# Altium schematic sheet ETHERNET_PHY_RGMII.SchDoc
size 594 x 420 mm; SheetNumber: 22; SheetTotal: 23
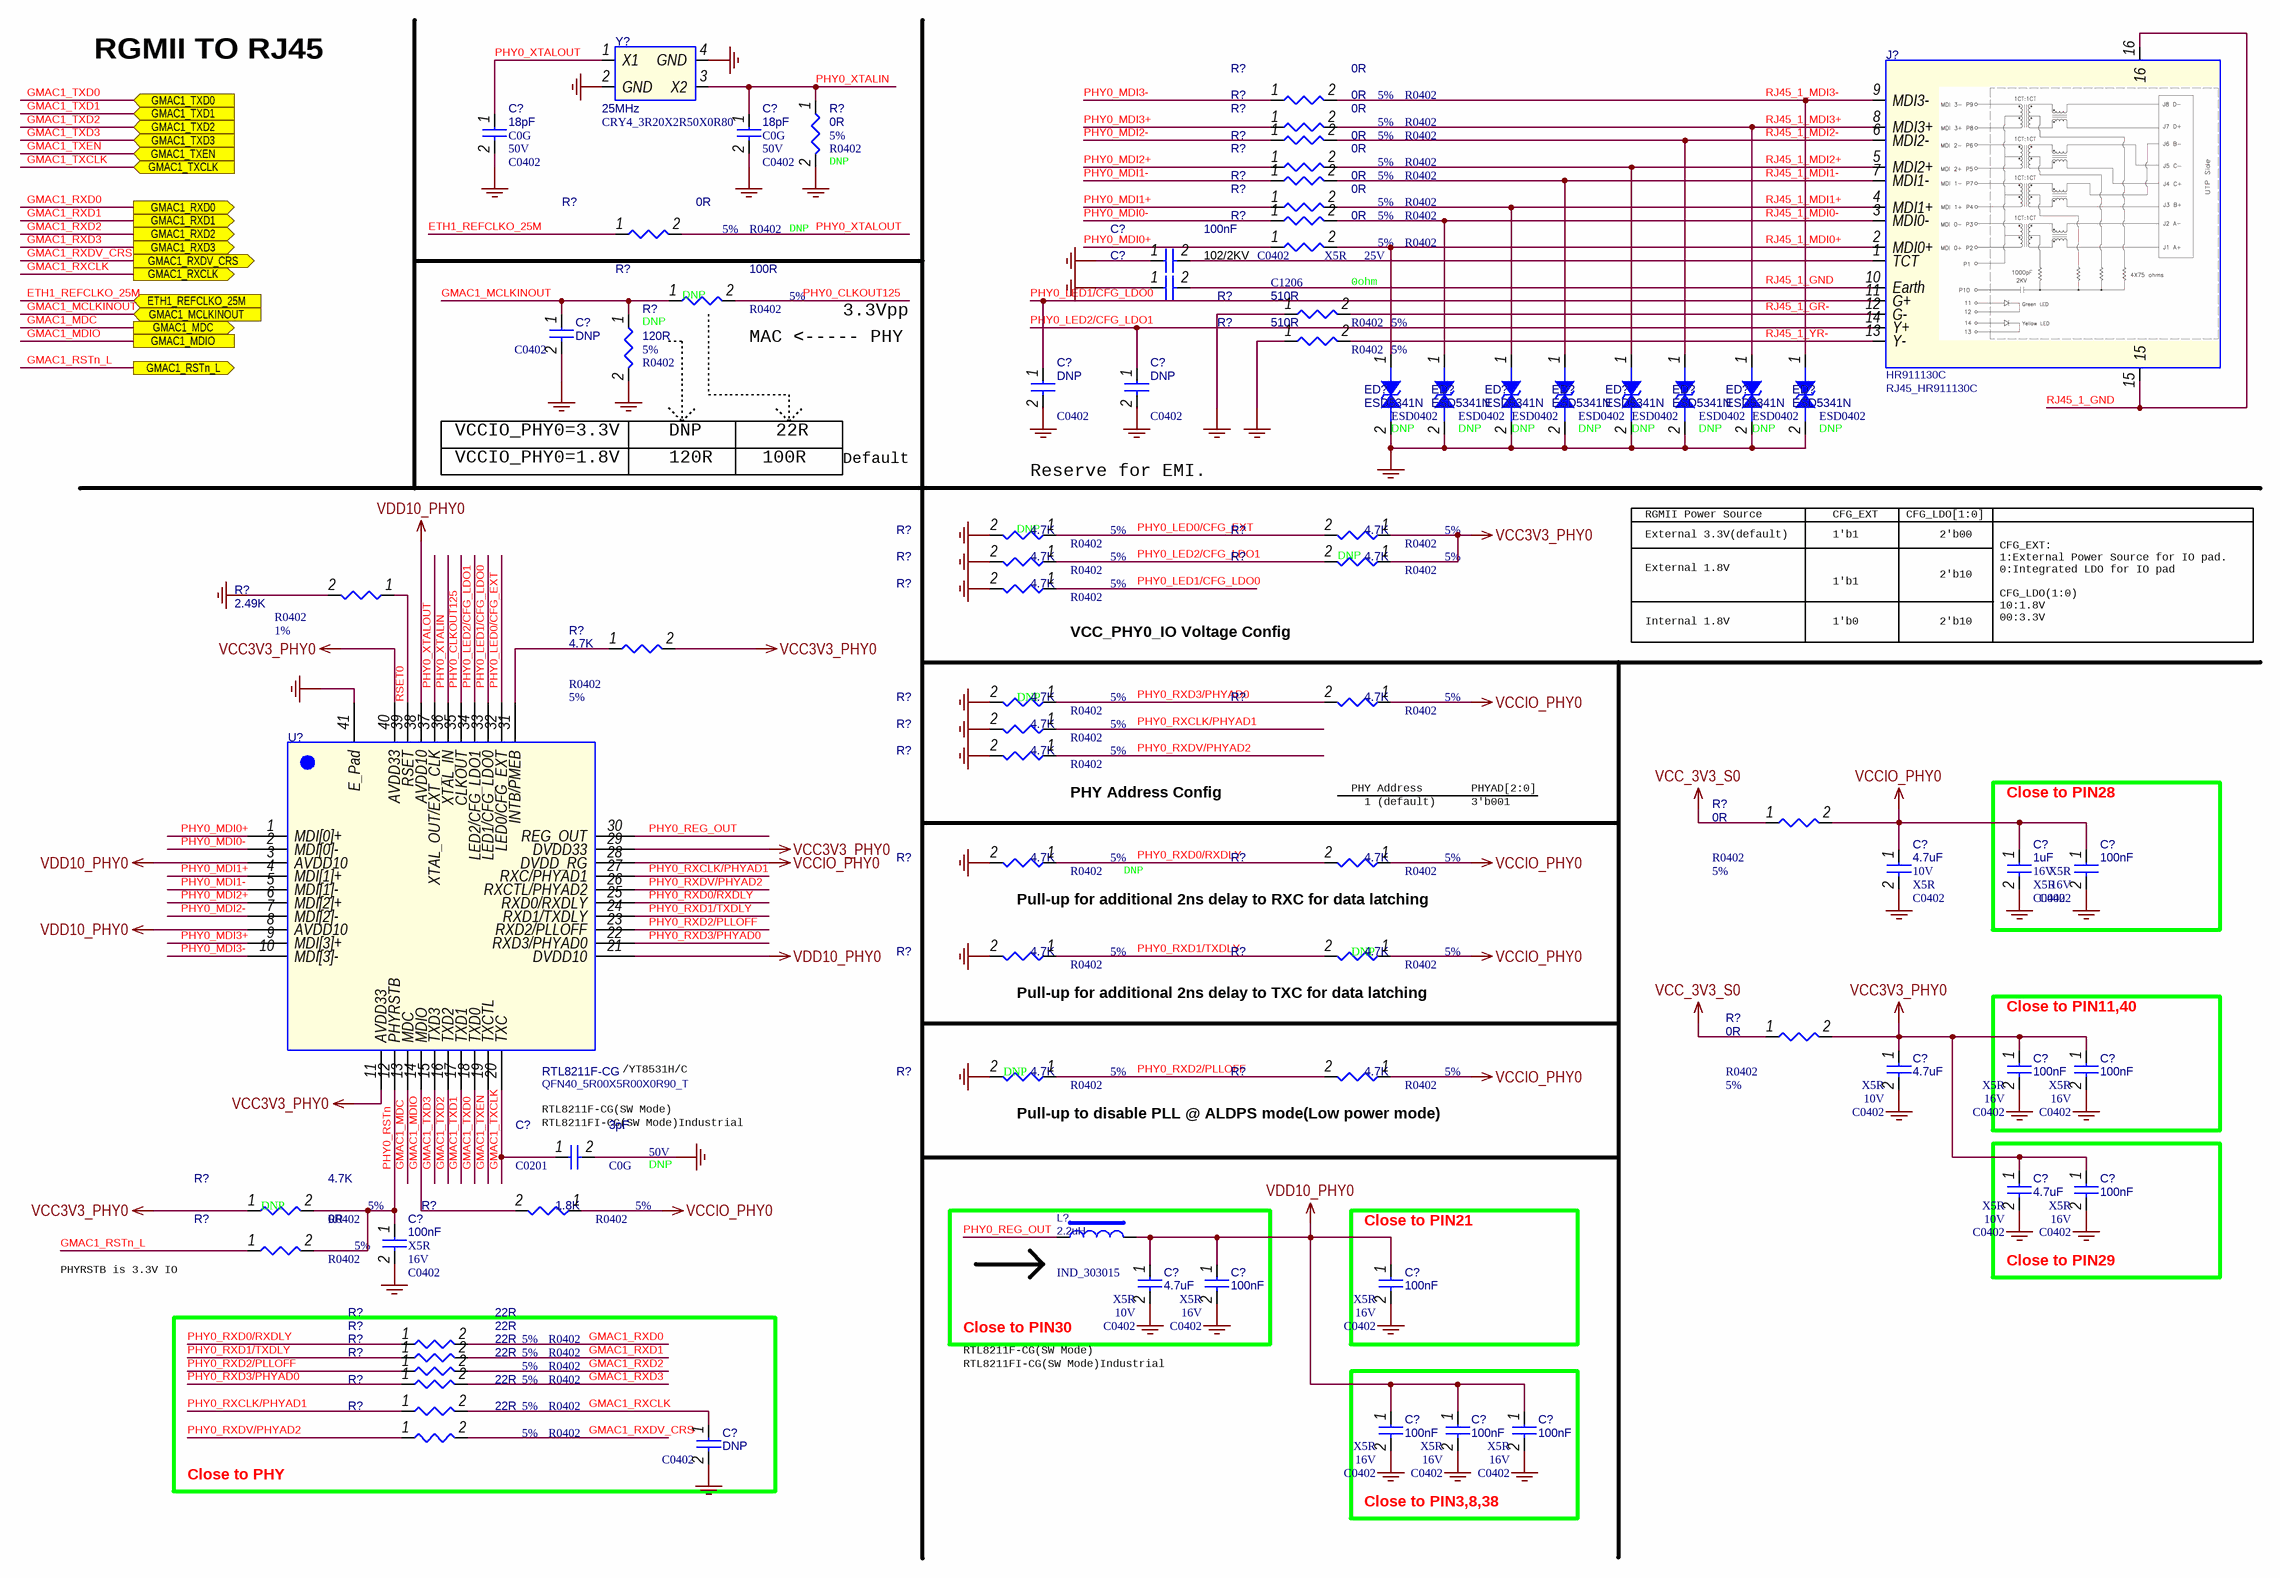
[diagram p0: ETHERNET_PHY_RGMII.SchDoc]

## Parts
(Parts that share a designator on the sheet are numbered #1, #2 ... from top to bottom, then left to right.)
C?#1  18pF  Dielectric: C0G  Voltage: 50V  [C0402]
C?#2  18pF  Dielectric: C0G  Voltage: 50V  [C0402]
C?#3  100nF  Dielectric: X5R  Voltage: 25V  [C0402]
C?#4  102/2KV  Option: 0ohm  [C1206]
C?#5  DNP  [C0402]
C?#6  DNP  [C0402]
C?#7  DNP  [C0402]
C?#8  4.7uF  Dielectric: X5R  Voltage: 10V  [C0402]
C?#9  1uF  Dielectric: X5R  Voltage: 16V  [C0402]
C?#10  100nF  Dielectric: X5R  Voltage: 16V  [C0402]
C?#11  4.7uF  Dielectric: X5R  Voltage: 10V  [C0402]
C?#12  100nF  Dielectric: X5R  Voltage: 16V  [C0402]
C?#13  100nF  Dielectric: X5R  Voltage: 16V  [C0402]
C?#14  3pF  Dielectric: C0G  Voltage: 50V  OPTION: DNP  [C0201]
C?#15  4.7uF  Dielectric: X5R  Voltage: 10V  [C0402]
C?#16  100nF  Dielectric: X5R  Voltage: 16V  [C0402]
C?#17  100nF  Dielectric: X5R  Voltage: 16V  [C0402]
C?#18  4.7uF  Dielectric: X5R  Voltage: 10V  [C0402]
C?#19  100nF  Dielectric: X5R  Voltage: 16V  [C0402]
C?#20  100nF  Dielectric: X5R  Voltage: 16V  [C0402]
C?#21  100nF  Dielectric: X5R  Voltage: 16V  [C0402]
C?#22  100nF  Dielectric: X5R  Voltage: 16V  [C0402]
C?#23  100nF  Dielectric: X5R  Voltage: 16V  [C0402]
C?#24  DNP  [C0402]
ED?#1  ESD5341N  OPTION: DNP  [ESD0402]
ED?#2  ESD5341N  OPTION: DNP  [ESD0402]
ED?#3  ESD5341N  OPTION: DNP  [ESD0402]
ED?#4  ESD5341N  OPTION: DNP  [ESD0402]
ED?#5  ESD5341N  OPTION: DNP  [ESD0402]
ED?#6  ESD5341N  OPTION: DNP  [ESD0402]
ED?#7  ESD5341N  OPTION: DNP  [ESD0402]
ED?#8  ESD5341N  OPTION: DNP  [ESD0402]
J?  HR911130C  PCB Footprint: RJ45_HR911130C  [RJ45_PULSE]
L?  2.2uH  [IND_303015]
R?#1  0R  Tolerance: 5%  OPTION: DNP  [R0402]
R?#2  0R  Tolerance: 5%  [R0402]
R?#3  0R  Tolerance: 5%  [R0402]
R?#4  0R  Tolerance: 5%  [R0402]
R?#5  0R  Tolerance: 5%  [R0402]
R?#6  0R  Tolerance: 5%  [R0402]
R?#7  0R  Tolerance: 5%  [R0402]
R?#8  0R  Tolerance: 5%  [R0402]
R?#9  0R  Tolerance: 5%  OPTION: DNP  [R0402]
R?#10  0R  Tolerance: 5%  [R0402]
R?#11  100R  Tolerance: 5%  OPTION: DNP  [R0402]
R?#12  120R  Tolerance: 5%  OPTION: DNP  [R0402]
R?#13  510R  Tolerance: 5%  [R0402]
R?#14  510R  Tolerance: 5%  [R0402]
R?#15  4.7K  Tolerance: 5%  option: DNP  [R0402]
R?#16  4.7K  Tolerance: 5%  [R0402]
R?#17  4.7K  Tolerance: 5%  [R0402]
R?#18  4.7K  Tolerance: 5%  OPTION: DNP  [R0402]
R?#19  4.7K  Tolerance: 5%  [R0402]
R?#20  2.49K  Tolerance: 1%  [R0402]
R?#21  4.7K  Tolerance: 5%  [R0402]
R?#22  4.7K  Tolerance: 5%  option: DNP  [R0402]
R?#23  4.7K  Tolerance: 5%  [R0402]
R?#24  4.7K  Tolerance: 5%  [R0402]
R?#25  4.7K  Tolerance: 5%  [R0402]
R?#26  0R  Tolerance: 5%  [R0402]
R?#27  4.7K  Tolerance: 5%  OPTION: DNP  [R0402]
R?#28  4.7K  Tolerance: 5%  [R0402]
R?#29  4.7K  Tolerance: 5%  [R0402]
R?#30  4.7K  Tolerance: 5%  option: DNP  [R0402]
R?#31  0R  Tolerance: 5%  [R0402]
R?#32  4.7K  Tolerance: 5%  option: DNP  [R0402]
R?#33  4.7K  Tolerance: 5%  [R0402]
R?#34  1.8K  Tolerance: 5%  [R0402]
R?#35  4.7K  Tolerance: 5%  Option: DNP  [R0402]
R?#36  0R  Tolerance: 5%  [R0402]
R?#37  22R  Tolerance: 5%  [R0402]
R?#38  22R  Tolerance: 5%  [R0402]
R?#39  22R  Tolerance: 5%  [R0402]
R?#40  22R  Tolerance: 5%  [R0402]
R?#41  22R  Tolerance: 5%  [R0402]
R?#42  22R  Tolerance: 5%  [R0402]
U?  RTL8211F-CG  PCB Footprint: QFN40_5R00X5R00X0R90_T  [QFN40_5R00X5R00X0R80_T]
Y?  25MHz  PCB Footprint: CRY4_3R20X2R50X0R80  [CRY-3225]

## Blocks framed on the sheet
Close to PIN28: C?#9 C?#10
Close to PIN11,40: C?#12 C?#13
Close to PIN29: C?#15 C?#16
Close to PIN30: C?#18 C?#19 L?
Close to PIN21: C?#20
Close to PHY: C?#24 R?#37-R?#42
Close to PIN3,8,38: C?#21-C?#23

## Ports
ETH1_REFCLKO_25M (in, see RK3588_GPIO_MAYBE_IMPORTANT_PINS[2A]), GMAC1_MCLKINOUT (in, see RK3588_GPIO_MAYBE_IMPORTANT_PINS[2B]), GMAC1_MDC (out, see RK3588_GPIO_MAYBE_IMPORTANT_PINS[2B]), GMAC1_MDIO (see RK3588_GPIO_MAYBE_IMPORTANT_PINS[2B]), GMAC1_RSTn_L (out, see RK3588_GPIO_MAYBE_IMPORTANT_PINS[2B]), GMAC1_RXCLK (out, see RK3588_GPIO_MAYBE_IMPORTANT_PINS[2A]), GMAC1_RXD0 (out, see RK3588_GPIO_MAYBE_IMPORTANT_PINS[2A]), GMAC1_RXD1 (out, see RK3588_GPIO_MAYBE_IMPORTANT_PINS[2A]), GMAC1_RXD2 (out, see RK3588_GPIO_MAYBE_IMPORTANT_PINS[2A]), GMAC1_RXD3 (out, see RK3588_GPIO_MAYBE_IMPORTANT_PINS[2A]), GMAC1_RXDV_CRS (out, see RK3588_GPIO_MAYBE_IMPORTANT_PINS[2A]), GMAC1_TXCLK (in, see RK3588_GPIO_MAYBE_IMPORTANT_PINS[2A]), GMAC1_TXD0 (in, see RK3588_GPIO_MAYBE_IMPORTANT_PINS[2A]), GMAC1_TXD1 (in, see RK3588_GPIO_MAYBE_IMPORTANT_PINS[2B]), GMAC1_TXD2 (in, see RK3588_GPIO_MAYBE_IMPORTANT_PINS[2A]), GMAC1_TXD3 (in, see RK3588_GPIO_MAYBE_IMPORTANT_PINS[2A]), GMAC1_TXEN (in, see RK3588_GPIO_MAYBE_IMPORTANT_PINS[2B])

## Nets
GND: C?#1.2 C?#2.2 C?#3.1 C?#4.1 C?#5.2 C?#6.2 C?#7.2 C?#8.2 C?#9.2 C?#10.2 C?#11.2 C?#12.2 C?#13.2 C?#14.2 C?#15.2 C?#16.2 C?#17.2 C?#18.2 C?#19.2 C?#20.2 C?#21.2 C?#22.2 C?#23.2 C?#24.2 ED?#1.2 ED?#2.2 ED?#3.2 ED?#4.2 ED?#5.2 ED?#6.2 ED?#7.2 ED?#8.2 R?#1.2 R?#12.2 R?#13.1 R?#14.1 R?#15.2 R?#17.2 R?#19.2 R?#20.2 R?#22.2 R?#24.2 R?#25.2 R?#27.2 R?#29.2 R?#32.2 U?.41(E_Pad) Y?.2(GND) Y?.4(GND)
VCC3V3_PHY0: C?#11.1 C?#12.1 C?#13.1 C?#15.1 C?#16.1 R?#16.1 R?#18.1 R?#21.2 R?#31.2 R?#35.1 U?.11(AVDD33) U?.29(DVDD33) U?.40(AVDD33)
VCC_3V3_S0: R?#26.1 R?#31.1
VCCIO_PHY0: C?#8.1 C?#9.1 C?#10.1 R?#23.1 R?#26.2 R?#28.1 R?#30.1 R?#33.1 R?#34.1 U?.28(DVDD_RG)
VDD10_PHY0: C?#18.1 C?#19.1 C?#20.1 C?#21.1 C?#22.1 C?#23.1 L?.2 U?.3(AVDD10) U?.8(AVDD10) U?.21(DVDD10) U?.38(AVDD10)
ETH1_REFCLKO_25M: R?#9.1 ; port ETH1_REFCLKO_25M
GMAC1_MCLKINOUT: C?#5.1 R?#11.1 R?#12.1 ; port GMAC1_MCLKINOUT
GMAC1_MDC: U?.13(MDC) ; port GMAC1_MDC
GMAC1_MDIO: R?#34.2 U?.14(MDIO) ; port GMAC1_MDIO
GMAC1_RSTn_L: R?#36.1 ; port GMAC1_RSTn_L
GMAC1_RXCLK: C?#24.1 R?#41.2 ; port GMAC1_RXCLK
GMAC1_RXD0: R?#37.2 ; port GMAC1_RXD0
GMAC1_RXD1: R?#38.2 ; port GMAC1_RXD1
GMAC1_RXD2: R?#39.2 ; port GMAC1_RXD2
GMAC1_RXD3: R?#40.2 ; port GMAC1_RXD3
GMAC1_RXDV_CRS: R?#42.2 ; port GMAC1_RXDV_CRS
GMAC1_TXCLK: C?#14.1 U?.20(TXC) ; port GMAC1_TXCLK
GMAC1_TXD0: U?.18(TXD0) ; port GMAC1_TXD0
GMAC1_TXD1: U?.17(TXD1) ; port GMAC1_TXD1
GMAC1_TXD2: U?.16(TXD2) ; port GMAC1_TXD2
GMAC1_TXD3: U?.15(TXD3) ; port GMAC1_TXD3
GMAC1_TXEN: U?.19(TXCTL) ; port GMAC1_TXEN
PHY0_CLKOUT125: R?#11.2 U?.35(CLKOUT)
PHY0_LED0/CFG_EXT: R?#15.1 R?#16.2 U?.32(LED0/CFG_EXT)
PHY0_LED1/CFG_LDO0: C?#6.1 J?.11(G+) R?#19.1 U?.33(LED1/CFG_LDO0)
PHY0_LED2/CFG_LDO1: C?#7.1 J?.14(Y+) R?#17.1 R?#18.2 U?.34(LED2/CFG_LDO1)
PHY0_MDI0+: R?#10.1 U?.1(MDI[0]+)
PHY0_MDI0-: R?#8.1 U?.2(MDI[0]-)
PHY0_MDI1+: R?#7.1 U?.4(MDI[1]+)
PHY0_MDI1-: R?#6.1 U?.5(MDI[1]-)
PHY0_MDI2+: R?#5.1 U?.6(MDI[2]+)
PHY0_MDI2-: R?#4.1 U?.7(MDI[2]-)
PHY0_MDI3+: R?#3.1 U?.9(MDI[3]+)
PHY0_MDI3-: R?#2.1 U?.10(MDI[3]-)
PHY0_REG_OUT: L?.1 U?.30(REG_OUT)
PHY0_RSTn: C?#17.1 R?#35.2 R?#36.2 U?.12(PHYRSTB)
PHY0_RXCLK/PHYAD1: R?#24.1 R?#41.1 U?.27(RXC/PHYAD1)
PHY0_RXD0/RXDLY: R?#27.1 R?#28.2 R?#37.1 U?.25(RXD0/RXDLY)
PHY0_RXD1/TXDLY: R?#29.1 R?#30.2 R?#38.1 U?.24(RXD1/TXDLY)
PHY0_RXD2/PLLOFF: R?#32.1 R?#33.2 R?#39.1 U?.23(RXD2/PLLOFF)
PHY0_RXD3/PHYAD0: R?#22.1 R?#23.2 R?#40.1 U?.22(RXD3/PHYAD0)
PHY0_RXDV/PHYAD2: R?#25.1 R?#42.1 U?.26(RXCTL/PHYAD2)
PHY0_XTALIN: C?#2.1 R?#1.1 U?.36(XTAL_IN) Y?.3(X2)
PHY0_XTALOUT: C?#1.1 R?#9.2 U?.37(XTAL_OUT/EXT_CLK) Y?.1(X1)
RJ45_1_GND: C?#4.2 J?.10(Earth) J?.15 J?.16
RJ45_1_GR-: J?.12(G-) R?#13.2
RJ45_1_MDI0+: ED?#1.1 J?.2(MDI0+) R?#10.2
RJ45_1_MDI0-: ED?#2.1 J?.3(MDI0-) R?#8.2
RJ45_1_MDI1+: ED?#3.1 J?.4(MDI1+) R?#7.2
RJ45_1_MDI1-: ED?#4.1 J?.7(MDI1-) R?#6.2
RJ45_1_MDI2+: ED?#5.1 J?.5(MDI2+) R?#5.2
RJ45_1_MDI2-: ED?#6.1 J?.6(MDI2-) R?#4.2
RJ45_1_MDI3+: ED?#7.1 J?.8(MDI3+) R?#3.2
RJ45_1_MDI3-: ED?#8.1 J?.9(MDI3-) R?#2.2
RJ45_1_YR-: J?.13(Y-) R?#14.2
RSET0: R?#20.1 U?.39(RSET)
NetC?#3_2: C?#3.2 J?.1(TCT)
NetR?#21_1: R?#21.1 U?.31(INTB/PMEB)

## Notes on the sheet
- RGMII TO RJ45
- (near R?#11) MAC <----- PHY
- 3.3Vpp
- VCCIO_PHY0=3.3V
- DNP
- 22R
- VCCIO_PHY0=1.8V
- 120R
- 100R
- Default
- Reserve for EMI.
- RGMII Power Source
- External 3.3V(default)
- External 1.8V
- CFG_EXT
- 1'b1
- CFG_LDO[1:0]
- 2'b00
- Internal 1.8V
- 1'b0
- 2'b10
- CFG_EXT:
  1:External Power Source for IO pad.
  0:Integrated LDO for IO pad
  CFG_LDO(1:0)
  10:1.8V
  00:3.3V
- (near R?#19) VCC_PHY0_IO Voltage Config
- (near R?#25) PHY Address Config
- PHY Address
- 1 (default)
- PHYAD[2:0]
- 3'b001
- (near R?#28) Pull-up for additional 2ns delay to RXC for data latching
- (near R?#29) Pull-up for additional 2ns delay to TXC for data latching
- (near U?) /YT8531H/C
- RTL8211F-CG(SW Mode)
- (near C?#14) RTL8211FI-CG(SW Mode)Industrial
- (near R?#33) Pull-up to disable PLL @ ALDPS mode(Low power mode)
- PHYRSTB is 3.3V IO
- RTL8211FI-CG(SW Mode)Industrial
- 420x594
- Формат А2

## Library data of the parts
C?#1 = CAP NP_Dup1: cap,18.00pF,+/-5%,50V,C0G,C0402; Part Reference: C6701; Manufacturer: TDK; RK PN: C1005C0G1H180J050BA; Priority: A; Tolerance: 5%; PCB Footprint: C0402; Value: 18pF; Part Type: C0402; Manufacturer PN: C1005C0G1H180J050BA; Created by: JJJ
C?#2 = CAP NP_Dup1: cap,18.00pF,+/-5%,50V,C0G,C0402; Part Reference: C6700; Manufacturer: TDK; RK PN: C1005C0G1H180J050BA; Priority: A; Tolerance: 5%; PCB Footprint: C0402; Value: 18pF; Part Type: C0402; Manufacturer PN: C1005C0G1H180J050BA; Created by: JJJ
C?#3 = CAP NP_Dup1: cap,100.00nF,+/-10%,25V,X5R,C0402; Part Reference: C6702; Manufacturer PN: C1005X5R1E104K050BC; Manufacturer: TDK; Tolerance: 10%; Priority: A; PCB Footprint: C0402; Value: 100nF; Created by: JJJ; Part Type: C0402; RK PN: C1005X5R1E104K050BC
C?#4 = CAP NP_Dup1: cap,10.00uF,+/-10%,50V,X5R,C1206; Part Reference: C6703; Manufacturer PN: C3216X5R1H106K160AB; Manufacturer: TDK; C_Voltage: 6.3V; Tolerance: 10%; Priority: A; Number: 37; Dielectric: X5R; PCB Footprint: C1206; Voltage: 50V; Value: 102/2KV; Created by: JJJ; Part Type: C1206; RK PN: C3216X5R1H106K160AB
C?#5 = CAP NP_Dup1: Did Not Place.; Part Reference: C6704; Manufacturer PN: DNPC0402; C_Voltage: 6.3V; Priority: A; Number: 37; PCB Footprint: C0402; Value: DNP; Created by: JJJ; Part Type: DNP; RK PN: DNPC0402
C?#6 = CAP NP_Dup1: Did Not Place.; Part Reference: C6750; Manufacturer PN: DNPC0402; Priority: A; PCB Footprint: C0402; Value: DNP; Created by: JJJ; Part Type: DNP; RK PN: DNPC0402
C?#7 = CAP NP_Dup1: Did Not Place.; Part Reference: C6751; Manufacturer PN: DNPC0402; Priority: A; PCB Footprint: C0402; Value: DNP; Created by: JJJ; Part Type: DNP; RK PN: DNPC0402
C?#8 = CAP NP_Dup1: cap,4.70uF,+/-10%,10V,X5R,C0402; Part Reference: C6707; Manufacturer: TDK; RK PN: C1005X5R1A475K050BC; Priority: A; C_Voltage: 6.3V; Tolerance: 10%; PCB Footprint: C0402; Value: 4.7uF; Part Type: C0402; Manufacturer PN: C1005X5R1A475K050BC; Created by: JJJ
C?#9 = CAP NP_Dup1: cap,1.00uF,+/-10%,16V,X5R,C0402; Part Reference: C6708; Manufacturer: TDK; RK PN: C1005X5R1C105K050BC; Priority: A; C_Voltage: 6.3V; Tolerance: 10%; PCB Footprint: C0402; Value: 1uF; Part Type: C0402; Manufacturer PN: C1005X5R1C105K050BC; Created by: JJJ
C?#10 = CAP NP_Dup1: cap,100.00nF,+/-10%,16V,X5R,C0402; Part Reference: C6709; Manufacturer: TDK; Number: 37; RK PN: C1005X5R1C104K050BA; Priority: A; Tolerance: 10%; C_Voltage: 6.3V; PCB Footprint: C0402; Value: 100nF; Part Type: C0402; Manufacturer PN: C1005X5R1C104K050BA; Created by: JJJ
C?#11 = CAP NP_Dup1: cap,4.70uF,+/-10%,10V,X5R,C0402; Part Reference: C6710; Manufacturer: TDK; RK PN: C1005X5R1A475K050BC; Priority: A; C_Voltage: 6.3V; Tolerance: 10%; PCB Footprint: C0402; Value: 4.7uF; Part Type: C0402; Manufacturer PN: C1005X5R1A475K050BC; Created by: JJJ
C?#12 = CAP NP_Dup1: cap,100.00nF,+/-10%,16V,X5R,C0402; Part Reference: C6711; Manufacturer PN: C1005X5R1C104K050BA; Manufacturer: TDK; C_Voltage: 6.3V; Tolerance: 10%; Priority: A; Number: 37; PCB Footprint: C0402; Value: 100nF; Created by: JJJ; Part Type: C0402; RK PN: C1005X5R1C104K050BA
C?#13 = CAP NP_Dup1: cap,100.00nF,+/-10%,16V,X5R,C0402; Part Reference: C6712; Manufacturer PN: C1005X5R1C104K050BA; Manufacturer: TDK; C_Voltage: 6.3V; Tolerance: 10%; Priority: A; Number: 37; PCB Footprint: C0402; Value: 100nF; Created by: JJJ; Part Type: C0402; RK PN: C1005X5R1C104K050BA
C?#14 = CAP NP_Dup1: cap,3.00pF,+/-0.25,50V,C0G,C0201; Part Reference: C6713; Manufacturer: TDK; RK PN: C0603C0G1H030C030BA; Priority: A; Tolerance: +/-0.25pF; PCB Footprint: C0201; Value: 3pF; Part Type: C0201; Manufacturer PN: C0603C0G1H030C030BA; Created by: JJJ
C?#15 = CAP NP_Dup1: cap,4.70uF,+/-10%,10V,X5R,C0402; Part Reference: C6715; Manufacturer: TDK; RK PN: C1005X5R1A475K050BC; Priority: A; C_Voltage: 6.3V; Tolerance: 10%; PCB Footprint: C0402; Value: 4.7uF; Part Type: C0402; Manufacturer PN: C1005X5R1A475K050BC; Created by: JJJ
C?#16 = CAP NP_Dup1: cap,100.00nF,+/-10%,16V,X5R,C0402; Part Reference: C6716; Manufacturer PN: C1005X5R1C104K050BA; Manufacturer: TDK; C_Voltage: 6.3V; Tolerance: 10%; Priority: A; Number: 37; PCB Footprint: C0402; Value: 100nF; Created by: JJJ; Part Type: C0402; RK PN: C1005X5R1C104K050BA
C?#17 = CAP NP_Dup1: cap,100.00nF,+/-10%,16V,X5R,C0402; Part Reference: C6714; Manufacturer PN: C1005X5R1C104K050BA; Manufacturer: TDK; Tolerance: 10%; Priority: A; PCB Footprint: C0402; Value: 100nF; Created by: JJJ; Part Type: C0402; RK PN: C1005X5R1C104K050BA
C?#18 = CAP NP_Dup1: cap,4.70uF,+/-10%,10V,X5R,C0402; Part Reference: C6717; Manufacturer PN: C1005X5R1A475K050BC; Manufacturer: TDK; Tolerance: 10%; C_Voltage: 6.3V; Priority: A; PCB Footprint: C0402; Value: 4.7uF; Created by: JJJ; Part Type: C0402; RK PN: C1005X5R1A475K050BC
C?#19 = CAP NP_Dup1: cap,100.00nF,+/-10%,16V,X5R,C0402; Part Reference: C6718; Manufacturer PN: C1005X5R1C104K050BA; Manufacturer: TDK; C_Voltage: 6.3V; Tolerance: 10%; Priority: A; Number: 37; PCB Footprint: C0402; Value: 100nF; Created by: JJJ; Part Type: C0402; RK PN: C1005X5R1C104K050BA
C?#20 = CAP NP_Dup1: cap,100.00nF,+/-10%,16V,X5R,C0402; Part Reference: C6719; Manufacturer PN: C1005X5R1C104K050BA; Manufacturer: TDK; C_Voltage: 6.3V; Tolerance: 10%; Priority: A; Number: 37; PCB Footprint: C0402; Value: 100nF; Created by: JJJ; Part Type: C0402; RK PN: C1005X5R1C104K050BA
C?#21 = CAP NP_Dup1: cap,100.00nF,+/-10%,16V,X5R,C0402; Part Reference: C6721; Manufacturer: TDK; Number: 37; RK PN: C1005X5R1C104K050BA; Priority: A; Tolerance: 10%; C_Voltage: 6.3V; PCB Footprint: C0402; Value: 100nF; Part Type: C0402; Manufacturer PN: C1005X5R1C104K050BA; Created by: JJJ
C?#22 = CAP NP_Dup1: cap,100.00nF,+/-10%,16V,X5R,C0402; Part Reference: C6722; Manufacturer: TDK; Number: 37; RK PN: C1005X5R1C104K050BA; Priority: A; Tolerance: 10%; C_Voltage: 6.3V; PCB Footprint: C0402; Value: 100nF; Part Type: C0402; Manufacturer PN: C1005X5R1C104K050BA; Created by: JJJ
C?#23 = CAP NP_Dup1: cap,100.00nF,+/-10%,16V,X5R,C0402; Part Reference: C6723; Manufacturer: TDK; Number: 37; RK PN: C1005X5R1C104K050BA; Priority: A; Tolerance: 10%; C_Voltage: 6.3V; PCB Footprint: C0402; Value: 100nF; Part Type: C0402; Manufacturer PN: C1005X5R1C104K050BA; Created by: JJJ
C?#24 = CAP NP_Dup1: Did Not Place.; Part Reference: C6720; Manufacturer PN: DNPC0402; C_Voltage: 6.3V; Priority: A; Number: 37; PCB Footprint: C0402; Value: DNP; Created by: JJJ; Part Type: DNP; RK PN: DNPC0402
ED?#1 = DIODE BI_DIR TRIG: 1-Line, Bi-directional, Transient Voltage Suppressors.1pF.; Part Reference: ED6700; Manufacturer: WillSemi(О¤¶ы°лµјМе); Priority: A; PCB Footprint: ESD0402; Value: ESD5341N; Created by: JJJ; Manufacturer PN: ESD5341N; Part Type: ESD_TVS; RK PN: ESD5341N
ED?#2 = DIODE BI_DIR TRIG: 1-Line, Bi-directional, Transient Voltage Suppressors.1pF.; Part Reference: ED6701; Manufacturer: WillSemi(О¤¶ы°лµјМе); Priority: A; PCB Footprint: ESD0402; Value: ESD5341N; Created by: JJJ; Manufacturer PN: ESD5341N; Part Type: ESD_TVS; RK PN: ESD5341N
ED?#3 = DIODE BI_DIR TRIG: 1-Line, Bi-directional, Transient Voltage Suppressors.1pF.; Part Reference: ED6702; Manufacturer: WillSemi(О¤¶ы°лµјМе); Priority: A; PCB Footprint: ESD0402; Value: ESD5341N; RK PN: ESD5341N; Part Type: ESD_TVS; Manufacturer PN: ESD5341N; Created by: JJJ
ED?#4 = DIODE BI_DIR TRIG: 1-Line, Bi-directional, Transient Voltage Suppressors.1pF.; Part Reference: ED6703; Manufacturer: WillSemi(О¤¶ы°лµјМе); Priority: A; PCB Footprint: ESD0402; Value: ESD5341N; Created by: JJJ; Manufacturer PN: ESD5341N; Part Type: ESD_TVS; RK PN: ESD5341N
ED?#5 = DIODE BI_DIR TRIG: 1-Line, Bi-directional, Transient Voltage Suppressors.1pF.; Part Reference: ED6704; Manufacturer: WillSemi(О¤¶ы°лµјМе); Priority: A; PCB Footprint: ESD0402; Value: ESD5341N; Created by: JJJ; Manufacturer PN: ESD5341N; Part Type: ESD_TVS; RK PN: ESD5341N
ED?#6 = DIODE BI_DIR TRIG: 1-Line, Bi-directional, Transient Voltage Suppressors.1pF.; Part Reference: ED6705; Manufacturer: WillSemi(О¤¶ы°лµјМе); Priority: A; PCB Footprint: ESD0402; Value: ESD5341N; RK PN: ESD5341N; Part Type: ESD_TVS; Manufacturer PN: ESD5341N; Created by: JJJ
ED?#7 = DIODE BI_DIR TRIG: 1-Line, Bi-directional, Transient Voltage Suppressors.1pF.; Part Reference: ED6706; Manufacturer: WillSemi(О¤¶ы°лµјМе); Priority: A; PCB Footprint: ESD0402; Value: ESD5341N; RK PN: ESD5341N; Part Type: ESD_TVS; Manufacturer PN: ESD5341N; Created by: JJJ
ED?#8 = DIODE BI_DIR TRIG: 1-Line, Bi-directional, Transient Voltage Suppressors.1pF.; Part Reference: ED6707; Manufacturer: WillSemi(О¤¶ы°лµјМе); Priority: A; PCB Footprint: ESD0402; Value: ESD5341N; RK PN: ESD5341N; Part Type: ESD_TVS; Manufacturer PN: ESD5341N; Created by: JJJ
J? = HR911130C_0: З§ХЧНшїЪЅУїЪЈ¬ДЪЦГ±дС№Жч; Part Reference: J6700; VAL: J00-0061; DESIG: 10/100 base TX LXT971A; BOI: RJ45; FAB: PULSE; DEV: CON_PULSE_J00-61; Priority: A; REF: J00-0061; Value: HR911130C; RK PN: HR911130C; Part Type: Ethernet Jack; Manufacturer Part Number: HR911130C; Created by: JJJ
L? = INDUCTORS OF FERRITE_Dup1: Power Inductor,2.2uH,0.3,IND_303015; Part Reference: L6700; Manufacturer PN: SWPA3015S2R2NT; Manufacturer: sunlord; Isat: 1.6A; DC Resistor: 0.06ohm; Resonace frequency: 86M; Tolerance: 30%; Priority: A; PCB Footprint: IND_303015; Value: 2.2uH; Created by: YTL; Irms: 1.6A; Part Type: POWER_IND; RK PN: SWPA3015S2R2NT
R?#1 = RESISTOR_Dup2: НЁУГєсД¤µзЧи,0R,+/-5%,R0402,1/16W.; Part Reference: R6701; Manufacturer: YAGEO; RK PN: RC0402JR-070RL; Priority: A; Wattage: 1/16W; PCB Footprint: R0402; Value: 0R; Part Type: НЁУГєсД¤µзЧи; Manufacturer PN: RC0402JR-070RL; Created by: YTL
R?#2 = RESISTOR_Dup2: НЁУГєсД¤µзЧи,0R,+/-5%,R0402,1/16W.; Part Reference: R6700; Manufacturer PN: RC0402JR-070RL; Manufacturer: YAGEO; Wattage: 1/16W; Priority: A; PCB Footprint: R0402; Value: 0R; Created by: YTL; Part Type: НЁУГєсД¤µзЧи; RK PN: RC0402JR-070RL
R?#3 = RESISTOR_Dup2: НЁУГєсД¤µзЧи,0R,+/-5%,R0402,1/16W.; Part Reference: R6702; Manufacturer: YAGEO; RK PN: RC0402JR-070RL; Priority: A; Wattage: 1/16W; PCB Footprint: R0402; Value: 0R; Part Type: НЁУГєсД¤µзЧи; Manufacturer PN: RC0402JR-070RL; Created by: YTL
R?#4 = RESISTOR_Dup2: НЁУГєсД¤µзЧи,0R,+/-5%,R0402,1/16W.; Part Reference: R6703; Manufacturer PN: RC0402JR-070RL; Manufacturer: YAGEO; Wattage: 1/16W; Priority: A; PCB Footprint: R0402; Value: 0R; Created by: YTL; Part Type: НЁУГєсД¤µзЧи; RK PN: RC0402JR-070RL
R?#5 = RESISTOR_Dup2: НЁУГєсД¤µзЧи,0R,+/-5%,R0402,1/16W.; Part Reference: R6704; Manufacturer: YAGEO; RK PN: RC0402JR-070RL; Priority: A; Wattage: 1/16W; PCB Footprint: R0402; Value: 0R; Part Type: НЁУГєсД¤µзЧи; Manufacturer PN: RC0402JR-070RL; Created by: YTL
R?#6 = RESISTOR_Dup2: НЁУГєсД¤µзЧи,0R,+/-5%,R0402,1/16W.; Part Reference: R6705; Manufacturer PN: RC0402JR-070RL; Manufacturer: YAGEO; Wattage: 1/16W; Priority: A; PCB Footprint: R0402; Value: 0R; Created by: YTL; Part Type: НЁУГєсД¤µзЧи; RK PN: RC0402JR-070RL
R?#7 = RESISTOR_Dup2: НЁУГєсД¤µзЧи,0R,+/-5%,R0402,1/16W.; Part Reference: R6706; Manufacturer: YAGEO; RK PN: RC0402JR-070RL; Priority: A; Wattage: 1/16W; PCB Footprint: R0402; Value: 0R; Part Type: НЁУГєсД¤µзЧи; Manufacturer PN: RC0402JR-070RL; Created by: YTL
R?#8 = RESISTOR_Dup2: НЁУГєсД¤µзЧи,0R,+/-5%,R0402,1/16W.; Part Reference: R6707; Manufacturer PN: RC0402JR-070RL; Manufacturer: YAGEO; Wattage: 1/16W; Priority: A; PCB Footprint: R0402; Value: 0R; Created by: YTL; Part Type: НЁУГєсД¤µзЧи; RK PN: RC0402JR-070RL
R?#9 = RESISTOR_Dup2: НЁУГєсД¤µзЧи,0R,+/-5%,R0402,1/16W.; Part Reference: R6708; Manufacturer: YAGEO; RK PN: RC0402JR-070RL; Priority: A; Wattage: 1/16W; PCB Footprint: R0402; Value: 0R; Part Type: НЁУГєсД¤µзЧи; Manufacturer PN: RC0402JR-070RL; Created by: YTL
R?#10 = RESISTOR_Dup2: НЁУГєсД¤µзЧи,0R,+/-5%,R0402,1/16W.; Part Reference: R6709; Manufacturer: YAGEO; RK PN: RC0402JR-070RL; Priority: A; Wattage: 1/16W; PCB Footprint: R0402; Value: 0R; Part Type: НЁУГєсД¤µзЧи; Manufacturer PN: RC0402JR-070RL; Created by: YTL
R?#11 = RESISTOR_Dup2: НЁУГєсД¤µзЧи,100R,+/-5%,R0402,1/16W.; Part Reference: R6710; Manufacturer PN: RC0402JR-07100RL; Manufacturer: YAGEO; Wattage: 1/16W; Priority: A; PCB Footprint: R0402; Value: 100R; Created by: YTL; Part Type: НЁУГєсД¤µзЧи; RK PN: RC0402JR-07100RL
R?#12 = RESISTOR_Dup2: НЁУГєсД¤µзЧи,120R,+/-5%,R0402,1/16W.; Part Reference: R6712; Manufacturer PN: RC0402JR-07120RL; Manufacturer: YAGEO; Wattage: 1/16W; Priority: A; PCB Footprint: R0402; Value: 120R; Created by: YTL; Part Type: НЁУГєсД¤µзЧи; RK PN: RC0402JR-07120RL
R?#13 = RESISTOR_Dup2: НЁУГєсД¤µзЧи,510R,+/-5%,R0402,1/16W.; Part Reference: R6711; Manufacturer PN: RC0402JR-07510RL; Manufacturer: YAGEO; Wattage: 1/16W; Priority: A; PCB Footprint: R0402; Value: 510R; Created by: YTL; Part Type: НЁУГєсД¤µзЧи; RK PN: RC0402JR-07510RL
R?#14 = RESISTOR_Dup2: НЁУГєсД¤µзЧи,510R,+/-5%,R0402,1/16W.; Part Reference: R6713; Manufacturer: YAGEO; RK PN: RC0402JR-07510RL; Priority: A; Wattage: 1/16W; PCB Footprint: R0402; Value: 510R; Part Type: НЁУГєсД¤µзЧи; Manufacturer PN: RC0402JR-07510RL; Created by: YTL
R?#15 = RESISTOR_Dup2: НЁУГєсД¤µзЧи,4K7,+/-5%,R0402,1/16W.; Part Reference: R6714; Manufacturer PN: RC0402JR-074K7L; Manufacturer: YAGEO; Wattage: 1/16W; Priority: A; PCB Footprint: R0402; Value: 4.7K; Created by: YTL; Part Type: НЁУГєсД¤µзЧи; RK PN: RC0402JR-074K7L
R?#16 = RESISTOR_Dup2: НЁУГєсД¤µзЧи,4K7,+/-5%,R0402,1/16W.; Part Reference: R6715; Manufacturer PN: RC0402JR-074K7L; Manufacturer: YAGEO; Wattage: 1/16W; Priority: A; PCB Footprint: R0402; Value: 4.7K; Created by: YTL; Part Type: НЁУГєсД¤µзЧи; RK PN: RC0402JR-074K7L
R?#17 = RESISTOR_Dup2: НЁУГєсД¤µзЧи,4K7,+/-5%,R0402,1/16W.; Part Reference: R6716; Manufacturer: YAGEO; RK PN: RC0402JR-074K7L; Priority: A; Wattage: 1/16W; PCB Footprint: R0402; Value: 4.7K; Part Type: НЁУГєсД¤µзЧи; Manufacturer PN: RC0402JR-074K7L; Created by: YTL
R?#18 = RESISTOR_Dup2: НЁУГєсД¤µзЧи,4K7,+/-5%,R0402,1/16W.; Part Reference: R6717; Manufacturer: YAGEO; RK PN: RC0402JR-074K7L; Priority: A; Wattage: 1/16W; PCB Footprint: R0402; Value: 4.7K; Part Type: НЁУГєсД¤µзЧи; Manufacturer PN: RC0402JR-074K7L; Created by: YTL
R?#19 = RESISTOR_Dup2: НЁУГєсД¤µзЧи,4K7,+/-5%,R0402,1/16W.; Part Reference: R6718; Manufacturer PN: RC0402JR-074K7L; Manufacturer: YAGEO; Wattage: 1/16W; Priority: A; PCB Footprint: R0402; Value: 4.7K; Created by: YTL; Part Type: НЁУГєсД¤µзЧи; RK PN: RC0402JR-074K7L
R?#20 = RESISTOR_Dup2: НЁУГєсД¤µзЧи,2K49,+/-1%,R0402,1/16W.; Part Reference: R6719; Manufacturer PN: RC0402FR-072K49L; Manufacturer: YAGEO; Wattage: 1/16W; Priority: A; PCB Footprint: R0402; Value: 2.49K; Created by: YTL; Part Type: НЁУГєсД¤µзЧи; RK PN: RC0402FR-072K49L
R?#21 = RESISTOR_Dup2: НЁУГєсД¤µзЧи,4K7,+/-5%,R0402,1/16W.; Part Reference: R6720; Manufacturer: YAGEO; RK PN: RC0402JR-074K7L; Priority: A; Wattage: 1/16W; PCB Footprint: R0402; Value: 4.7K; Part Type: НЁУГєсД¤µзЧи; Manufacturer PN: RC0402JR-074K7L; Created by: YTL
R?#22 = RESISTOR_Dup2: НЁУГєсД¤µзЧи,4K7,+/-5%,R0402,1/16W.; Part Reference: R6721; Manufacturer: YAGEO; RK PN: RC0402JR-074K7L; Priority: A; Wattage: 1/16W; PCB Footprint: R0402; Value: 4.7K; Part Type: НЁУГєсД¤µзЧи; Manufacturer PN: RC0402JR-074K7L; Created by: YTL
R?#23 = RESISTOR_Dup2: НЁУГєсД¤µзЧи,4K7,+/-5%,R0402,1/16W.; Part Reference: R6722; Manufacturer PN: RC0402JR-074K7L; Manufacturer: YAGEO; Wattage: 1/16W; Priority: A; PCB Footprint: R0402; Value: 4.7K; Created by: YTL; Part Type: НЁУГєсД¤µзЧи; RK PN: RC0402JR-074K7L
R?#24 = RESISTOR_Dup2: НЁУГєсД¤µзЧи,4K7,+/-5%,R0402,1/16W.; Part Reference: R6723; Manufacturer: YAGEO; RK PN: RC0402JR-074K7L; Priority: A; Wattage: 1/16W; PCB Footprint: R0402; Value: 4.7K; Part Type: НЁУГєсД¤µзЧи; Manufacturer PN: RC0402JR-074K7L; Created by: YTL
R?#25 = RESISTOR_Dup2: НЁУГєсД¤µзЧи,4K7,+/-5%,R0402,1/16W.; Part Reference: R6724; Manufacturer: YAGEO; RK PN: RC0402JR-074K7L; Priority: A; Wattage: 1/16W; PCB Footprint: R0402; Value: 4.7K; Part Type: НЁУГєсД¤µзЧи; Manufacturer PN: RC0402JR-074K7L; Created by: YTL
R?#26 = RESISTOR_Dup2: НЁУГєсД¤µзЧи,0R,+/-5%,R0402,1/16W.; Part Reference: R6727; Manufacturer PN: RC0402JR-070RL; Manufacturer: YAGEO; Wattage: 1/16W; Priority: A; PCB Footprint: R0402; Value: 0R; Created by: YTL; Part Type: НЁУГєсД¤µзЧи; RK PN: RC0402JR-070RL
R?#27 = RESISTOR_Dup2: НЁУГєсД¤µзЧи,4K7,+/-5%,R0402,1/16W.; Part Reference: R6725; Manufacturer PN: RC0402JR-074K7L; Manufacturer: YAGEO; Wattage: 1/16W; Priority: A; PCB Footprint: R0402; Value: 4.7K; Created by: YTL; Part Type: НЁУГєсД¤µзЧи; RK PN: RC0402JR-074K7L
R?#28 = RESISTOR_Dup2: НЁУГєсД¤µзЧи,4K7,+/-5%,R0402,1/16W.; Part Reference: R6726; Manufacturer: YAGEO; RK PN: RC0402JR-074K7L; Priority: A; Wattage: 1/16W; PCB Footprint: R0402; Value: 4.7K; Part Type: НЁУГєсД¤µзЧи; Manufacturer PN: RC0402JR-074K7L; Created by: YTL
R?#29 = RESISTOR_Dup2: НЁУГєсД¤µзЧи,4K7,+/-5%,R0402,1/16W.; Part Reference: R6729; Manufacturer PN: RC0402JR-074K7L; Manufacturer: YAGEO; Wattage: 1/16W; Priority: A; PCB Footprint: R0402; Value: 4.7K; Created by: YTL; Part Type: НЁУГєсД¤µзЧи; RK PN: RC0402JR-074K7L
R?#30 = RESISTOR_Dup2: НЁУГєсД¤µзЧи,4K7,+/-5%,R0402,1/16W.; Part Reference: R6728; Manufacturer: YAGEO; RK PN: RC0402JR-074K7L; Priority: A; Wattage: 1/16W; PCB Footprint: R0402; Value: 4.7K; Part Type: НЁУГєсД¤µзЧи; Manufacturer PN: RC0402JR-074K7L; Created by: YTL
R?#31 = RESISTOR_Dup2: НЁУГєсД¤µзЧи,0R,+/-5%,R0402,1/16W.; Part Reference: R6732; Manufacturer PN: RC0402JR-070RL; Manufacturer: YAGEO; Wattage: 1/16W; Priority: A; PCB Footprint: R0402; Value: 0R; Created by: YTL; Part Type: НЁУГєсД¤µзЧи; RK PN: RC0402JR-070RL
R?#32 = RESISTOR_Dup2: НЁУГєсД¤µзЧи,4K7,+/-5%,R0402,1/16W.; Part Reference: R6730; Manufacturer: YAGEO; RK PN: RC0402JR-074K7L; Priority: A; Wattage: 1/16W; PCB Footprint: R0402; Value: 4.7K; Part Type: НЁУГєсД¤µзЧи; Manufacturer PN: RC0402JR-074K7L; Created by: YTL
R?#33 = RESISTOR_Dup2: НЁУГєсД¤µзЧи,4K7,+/-5%,R0402,1/16W.; Part Reference: R6731; Manufacturer PN: RC0402JR-074K7L; Manufacturer: YAGEO; Wattage: 1/16W; Priority: A; PCB Footprint: R0402; Value: 4.7K; Created by: YTL; Part Type: НЁУГєсД¤µзЧи; RK PN: RC0402JR-074K7L
R?#34 = RESISTOR_Dup2: НЁУГєсД¤µзЧи,1K8,+/-5%,R0402,1/16W.; Part Reference: R6734; Manufacturer: YAGEO; RK PN: RC0402JR-071K8L; Priority: A; Wattage: 1/16W; PCB Footprint: R0402; Value: 1.8K; Part Type: НЁУГєсД¤µзЧи; Manufacturer PN: RC0402JR-071K8L; Created by: YTL
R?#35 = RESISTOR_Dup2: НЁУГєсД¤µзЧи,4K7,+/-5%,R0402,1/16W.; Part Reference: R6733; Manufacturer PN: RC0402JR-074K7L; Manufacturer: YAGEO; Wattage: 1/16W; Priority: A; PCB Footprint: R0402; Value: 4.7K; Created by: YTL; Part Type: НЁУГєсД¤µзЧи; RK PN: RC0402JR-074K7L
R?#36 = RESISTOR_Dup2: НЁУГєсД¤µзЧи,0R,+/-5%,R0402,1/16W.; Part Reference: R6735; Manufacturer PN: RC0402JR-070RL; Manufacturer: YAGEO; Wattage: 1/16W; Priority: A; PCB Footprint: R0402; Value: 0R; Created by: YTL; Part Type: НЁУГєсД¤µзЧи; RK PN: RC0402JR-070RL
R?#37 = RESISTOR_Dup2: НЁУГєсД¤µзЧи,22R,+/-5%,R0402,1/16W.; Part Reference: R6736; Manufacturer PN: RC0402JR-0722RL; Manufacturer: YAGEO; Wattage: 1/16W; Priority: A; PCB Footprint: R0402; Value: 22R; Created by: YTL; Part Type: НЁУГєсД¤µзЧи; RK PN: RC0402JR-0722RL
R?#38 = RESISTOR_Dup2: НЁУГєсД¤µзЧи,22R,+/-5%,R0402,1/16W.; Part Reference: R6737; Manufacturer: YAGEO; RK PN: RC0402JR-0722RL; Priority: A; Wattage: 1/16W; PCB Footprint: R0402; Value: 22R; Part Type: НЁУГєсД¤µзЧи; Manufacturer PN: RC0402JR-0722RL; Created by: YTL
R?#39 = RESISTOR_Dup2: НЁУГєсД¤µзЧи,22R,+/-5%,R0402,1/16W.; Part Reference: R6738; Manufacturer: YAGEO; RK PN: RC0402JR-0722RL; Priority: A; Wattage: 1/16W; PCB Footprint: R0402; Value: 22R; Part Type: НЁУГєсД¤µзЧи; Manufacturer PN: RC0402JR-0722RL; Created by: YTL
R?#40 = RESISTOR_Dup2: НЁУГєсД¤µзЧи,22R,+/-5%,R0402,1/16W.; Part Reference: R6739; Manufacturer: YAGEO; RK PN: RC0402JR-0722RL; Priority: A; Wattage: 1/16W; PCB Footprint: R0402; Value: 22R; Part Type: НЁУГєсД¤µзЧи; Manufacturer PN: RC0402JR-0722RL; Created by: YTL
R?#41 = RESISTOR_Dup2: НЁУГєсД¤µзЧи,22R,+/-5%,R0402,1/16W.; Part Reference: R6740; Manufacturer: YAGEO; RK PN: RC0402JR-0722RL; Priority: A; Wattage: 1/16W; PCB Footprint: R0402; Value: 22R; Part Type: НЁУГєсД¤µзЧи; Manufacturer PN: RC0402JR-0722RL; Created by: YTL
R?#42 = RESISTOR_Dup2: НЁУГєсД¤µзЧи,22R,+/-5%,R0402,1/16W.; Part Reference: R6741; Manufacturer: YAGEO; RK PN: RC0402JR-0722RL; Priority: A; Wattage: 1/16W; PCB Footprint: R0402; Value: 22R; Part Type: НЁУГєсД¤µзЧи; Manufacturer PN: RC0402JR-0722RL; Created by: YTL
U? = Ethernet_RTL8211F: Integrated 10/100/1000 Gigabit Ethernet TransceiverЈ¬Supports IEEE 802.3az-2010,; Part Reference: U6700; Manufacturer: RealTek(ИркЕ); Priority: A; Value: RTL8211F-CG; RK PN: RTL8211F-CG; Part Type: Ethernet; Manufacturer PN: RTL8211F-CG; Created by: JJJ
Y? = CRYSTAL_4P: ОЮФґѕ§ХсЈ¬25MЈ¬3225,ЎА10ppmЈ¬10pFЈ¬Hosonic; Part Reference: Y6700; Manufacturer PN: E3SB25.0000F10E11; Manufacturer: Hosonic(єиРЗµзЧУ); Priority: A; Value: 25MHz; Created by: JJJ; Part Type: CRYSTAL; RK PN: E3SB25.0000F10E11